# EAGLE schematic boardv2mcu (EAGLE 6.6.0)
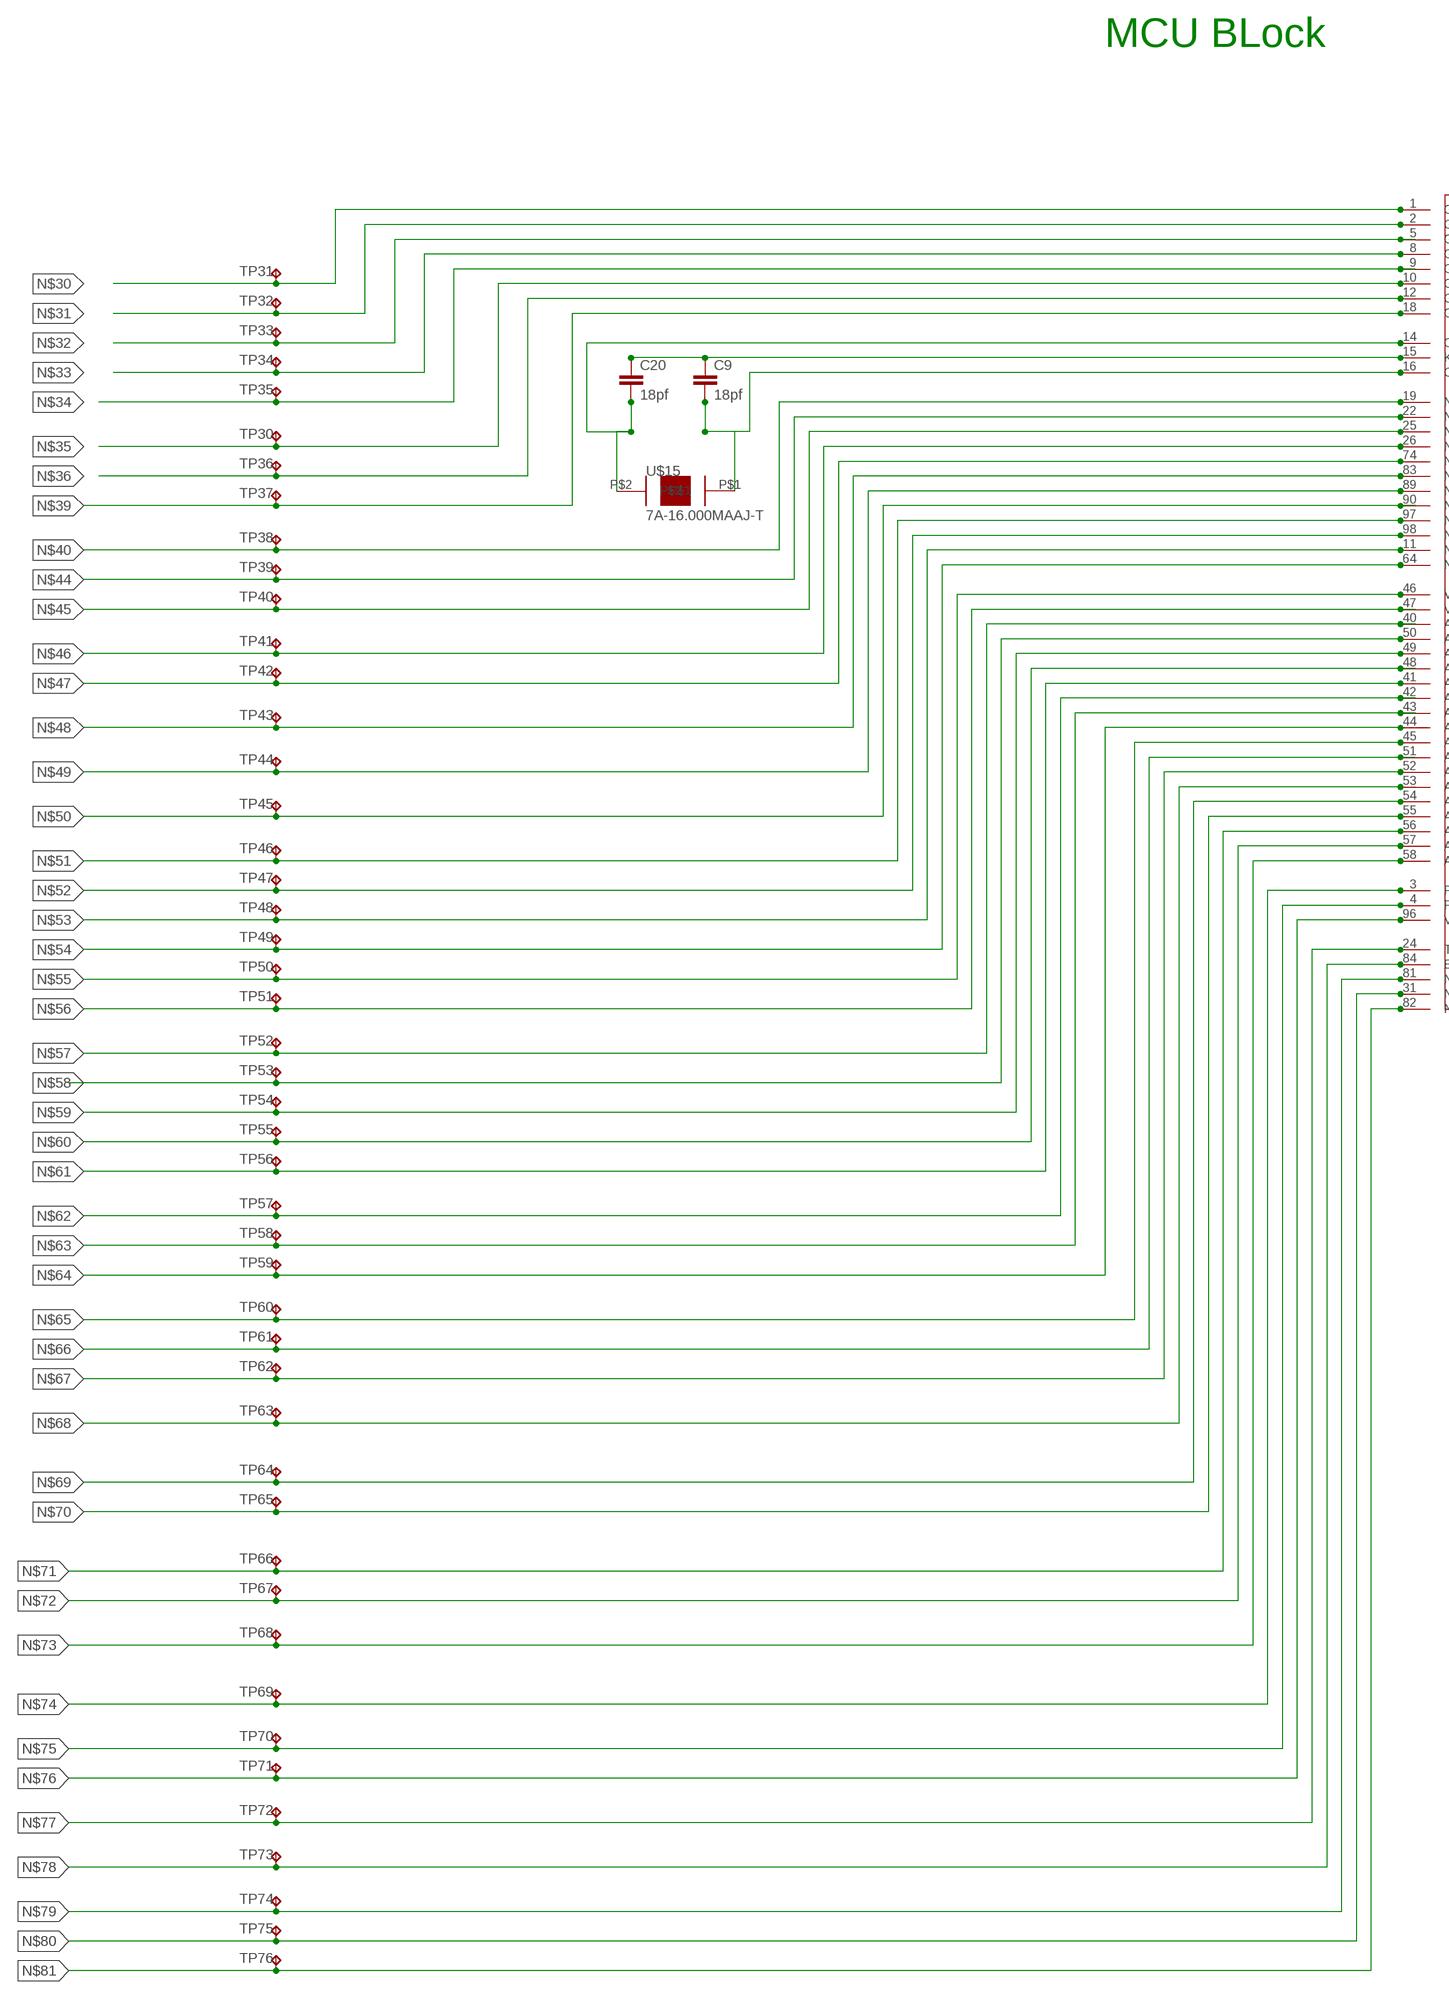
[diagram p0: schematic, sheet 1, part 1 of 2]
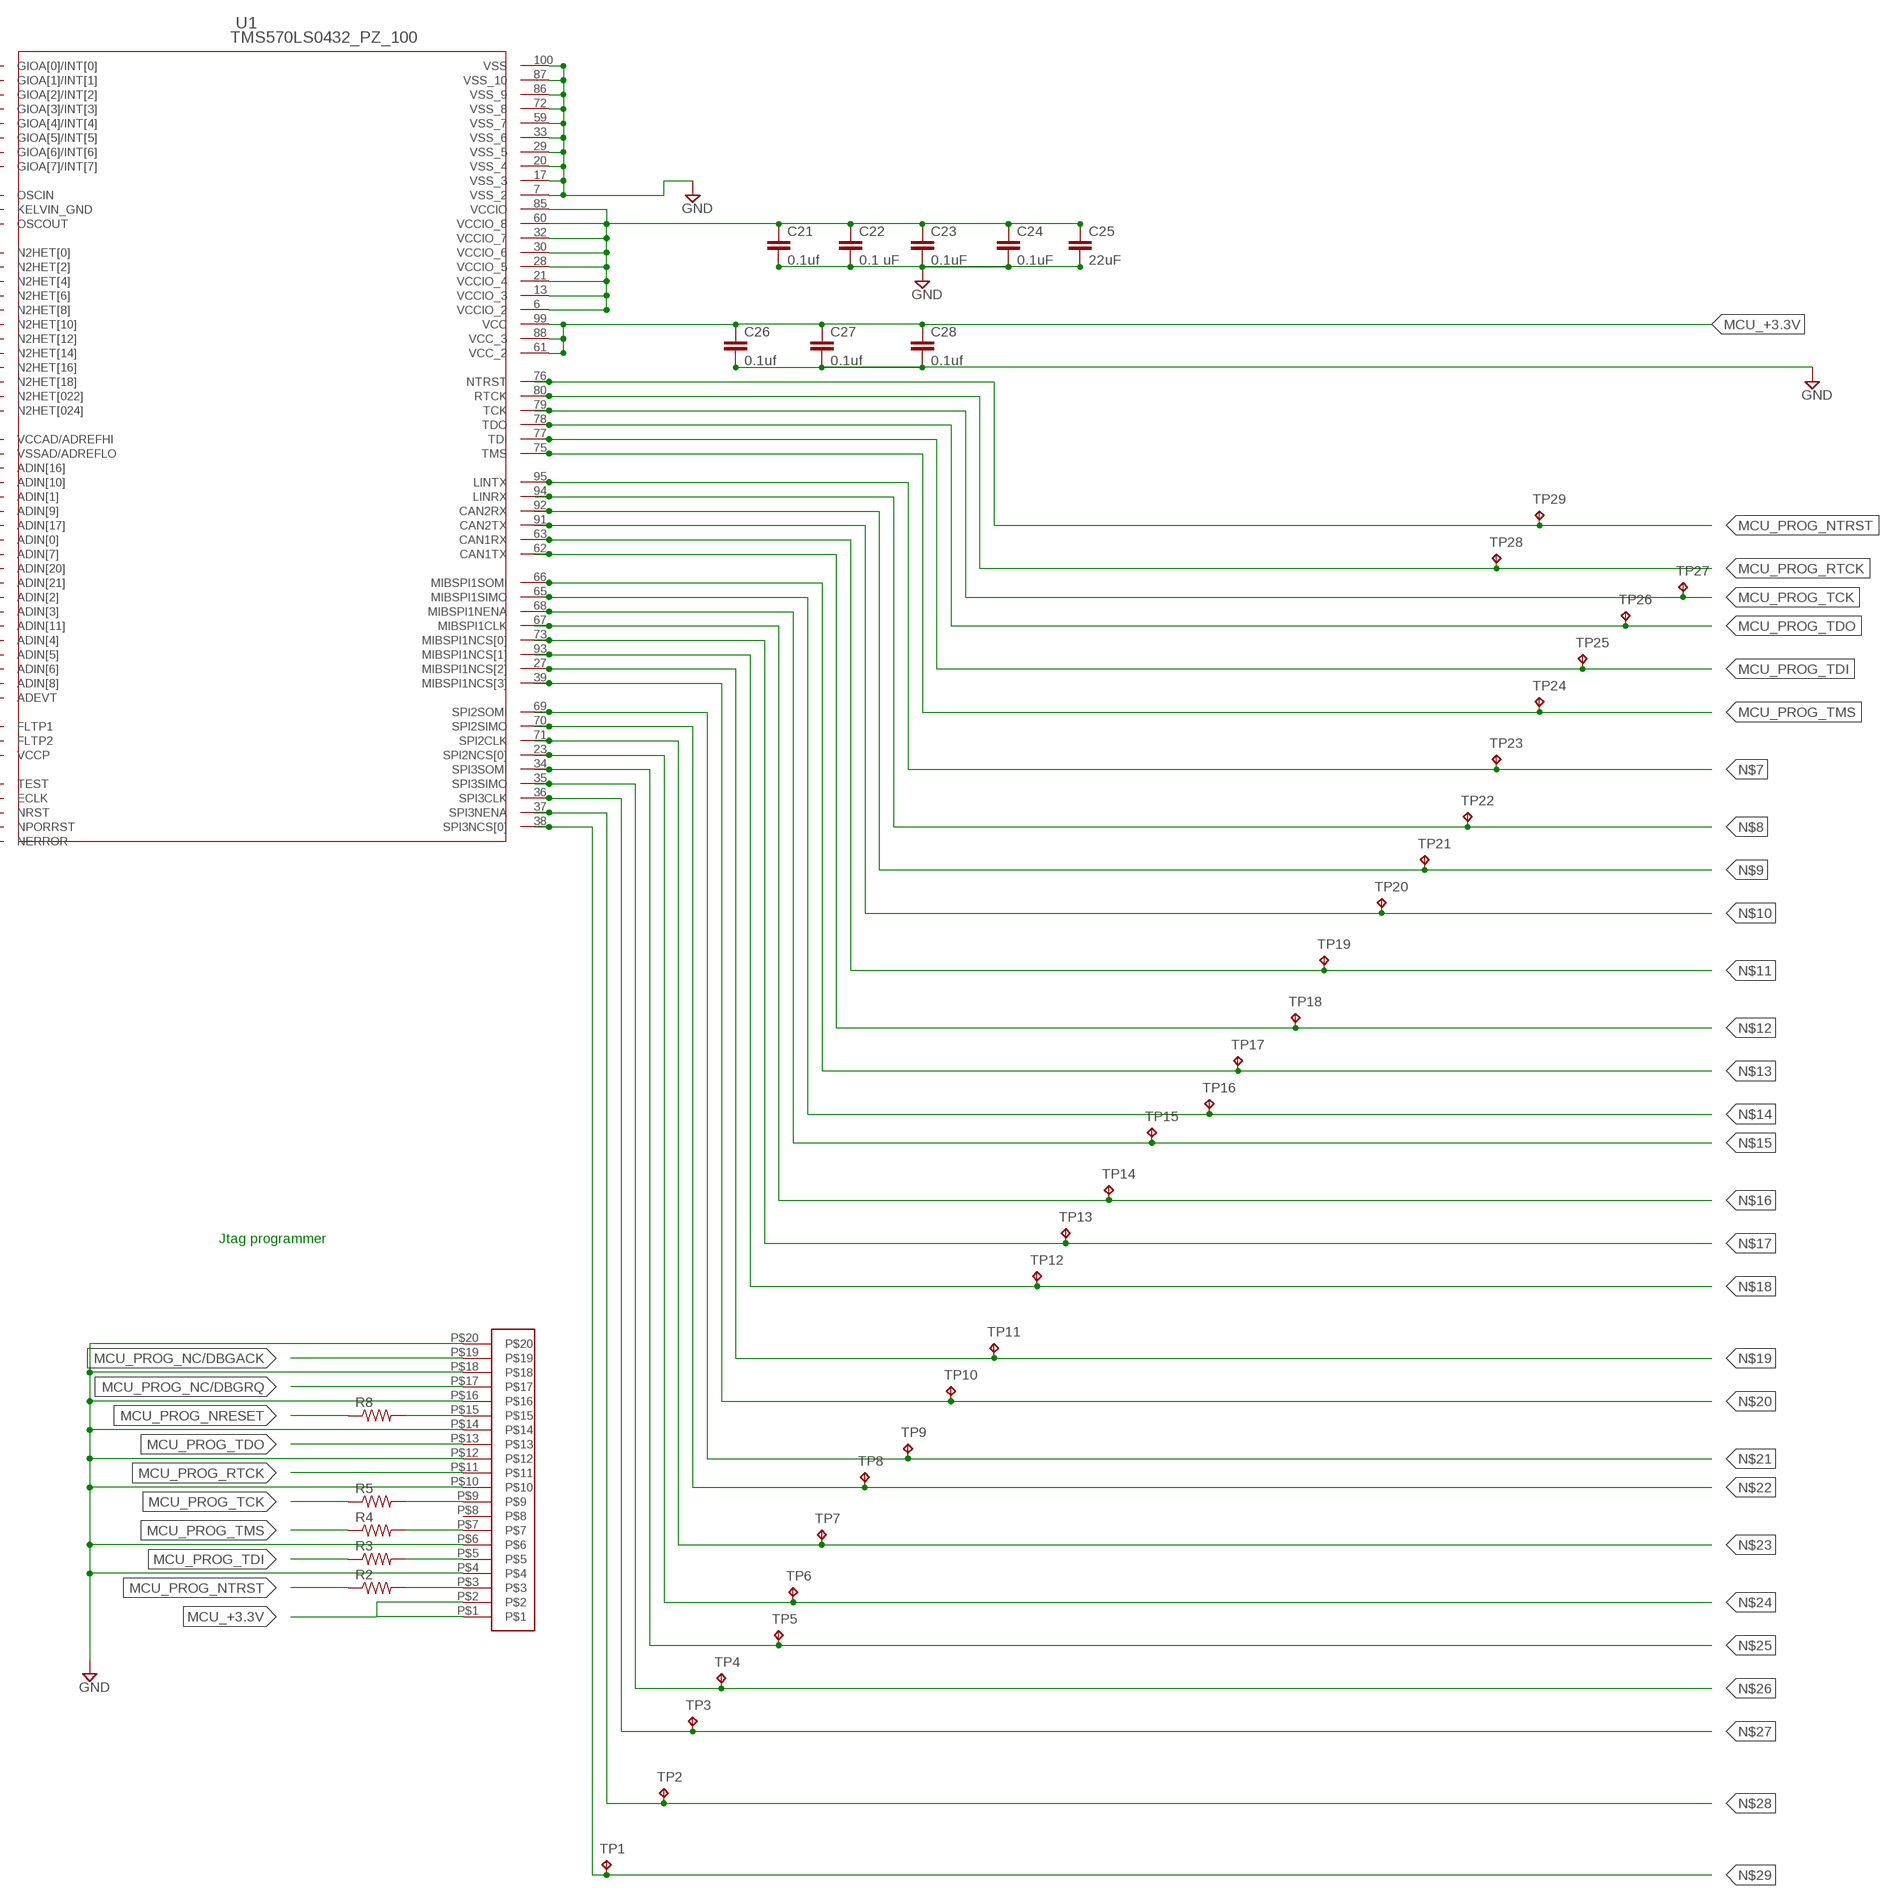
[diagram p1: schematic, sheet 1, part 2 of 2]

## Parts
C9  18pf  C-EUC0603  [C0603]
C20  18pf  C-EUC0603  [C0603]
C21  0.1uf  C-EUC0603  [C0603]
C22  0.1 uF  C-EUC0603  [C0603]
C23  0.1uF  C-EUC0603  [C0603]
C24  0.1uF  C-EUC0603  [C0603]
C25  22uF  C-EUC0603  [C0603]
C26  0.1uf  C-EUC0603  [C0603]
C27  0.1uf  C-EUC0603  [C0603]
C28  0.1uf  C-EUC0603  [C0603]
R2  RESISTOR0603-RES  [0603-RES]
R3  RESISTOR0603-RES  [0603-RES]
R4  RESISTOR0603-RES  [0603-RES]
R5  RESISTOR0603-RES  [0603-RES]
R8  RESISTOR0603-RES  [0603-RES]
TP1  TPB2,54  [B2,54]
TP2  TPB2,54  [B2,54]
TP3  TPB2,54  [B2,54]
TP4  TPB2,54  [B2,54]
TP5  TPB2,54  [B2,54]
TP6  TPB2,54  [B2,54]
TP7  TPB2,54  [B2,54]
TP8  TPB2,54  [B2,54]
TP9  TPB2,54  [B2,54]
TP10  TPB2,54  [B2,54]
TP11  TPB2,54  [B2,54]
TP12  TPB2,54  [B2,54]
TP13  TPB2,54  [B2,54]
TP14  TPB2,54  [B2,54]
TP15  TPB2,54  [B2,54]
TP16  TPB2,54  [B2,54]
TP17  TPB2,54  [B2,54]
TP18  TPB2,54  [B2,54]
TP19  TPB2,54  [B2,54]
TP20  TPB2,54  [B2,54]
TP21  TPB2,54  [B2,54]
TP22  TPB2,54  [B2,54]
TP23  TPB2,54  [B2,54]
TP24  TPB2,54  [B2,54]
TP25  TPB2,54  [B2,54]
TP26  TPB2,54  [B2,54]
TP27  TPB2,54  [B2,54]
TP28  TPB2,54  [B2,54]
TP29  TPB2,54  [B2,54]
TP30  TPB2,54  [B2,54]
TP31  TPB2,54  [B2,54]
TP32  TPB2,54  [B2,54]
TP33  TPB2,54  [B2,54]
TP34  TPB2,54  [B2,54]
TP35  TPB2,54  [B2,54]
TP36  TPB2,54  [B2,54]
TP37  TPB2,54  [B2,54]
TP38  TPB2,54  [B2,54]
TP39  TPB2,54  [B2,54]
TP40  TPB2,54  [B2,54]
TP41  TPB2,54  [B2,54]
TP42  TPB2,54  [B2,54]
TP43  TPB2,54  [B2,54]
TP44  TPB2,54  [B2,54]
TP45  TPB2,54  [B2,54]
TP46  TPB2,54  [B2,54]
TP47  TPB2,54  [B2,54]
TP48  TPB2,54  [B2,54]
TP49  TPB2,54  [B2,54]
TP50  TPB2,54  [B2,54]
TP51  TPB2,54  [B2,54]
TP52  TPB2,54  [B2,54]
TP53  TPB2,54  [B2,54]
TP54  TPB2,54  [B2,54]
TP55  TPB2,54  [B2,54]
TP56  TPB2,54  [B2,54]
TP57  TPB2,54  [B2,54]
TP58  TPB2,54  [B2,54]
TP59  TPB2,54  [B2,54]
TP60  TPB2,54  [B2,54]
TP61  TPB2,54  [B2,54]
TP62  TPB2,54  [B2,54]
TP63  TPB2,54  [B2,54]
TP64  TPB2,54  [B2,54]
TP65  TPB2,54  [B2,54]
TP66  TPB2,54  [B2,54]
TP67  TPB2,54  [B2,54]
TP68  TPB2,54  [B2,54]
TP69  TPB2,54  [B2,54]
TP70  TPB2,54  [B2,54]
TP71  TPB2,54  [B2,54]
TP72  TPB2,54  [B2,54]
TP73  TPB2,54  [B2,54]
TP74  TPB2,54  [B2,54]
TP75  TPB2,54  [B2,54]
TP76  TPB2,54  [B2,54]
U1  TMS570LS0432_PZ_100  [PZ100]
U$1  JTAG20PIN  [15-80-0201]
U$15  7A-16.000MAAJ-T  [2-SMD]

## Nets
GND: C21.2 C22.2 C23.2 C24.2 C25.2 C26.2 C27.2 C28.2 U1.7(VSS_2) U1.17(VSS_3) U1.20(VSS_4) U1.29(VSS_5) U1.33(VSS_6) U1.59(VSS_7) U1.72(VSS_8) U1.86(VSS_9) U1.87(VSS_10) U1.100(VSS) U$1.P$4 U$1.P$6 U$1.P$10 U$1.P$12 U$1.P$14 U$1.P$16 U$1.P$18 U$1.P$20
MCU_+3.3V: C26.1 C27.1 C28.1 U1.61(VCC_2) U1.88(VCC_3) U1.99(VCC) U$1.P$1 U$1.P$2
MCU_PROG_NC/DBGACK: U$1.P$19
MCU_PROG_NC/DBGRQ: U$1.P$17
MCU_PROG_NRESET: R8.1
MCU_PROG_NTRST: R2.2 TP29.TP U1.76(NTRST) U$1.P$3
MCU_PROG_RTCK: TP28.TP U1.80(RTCK) U$1.P$11
MCU_PROG_TCK: R5.2 TP27.TP U1.79(TCK) U$1.P$9
MCU_PROG_TDI: R3.2 TP25.TP U1.77(TDI) U$1.P$5
MCU_PROG_TDO: TP26.TP U1.78(TDO) U$1.P$13
MCU_PROG_TMS: R4.2 TP24.TP U1.75(TMS) U$1.P$7
N$7: TP23.TP U1.95(LINTX)
N$8: TP22.TP U1.94(LINRX)
N$9: TP21.TP U1.92(CAN2RX)
N$10: TP20.TP U1.91(CAN2TX)
N$11: TP19.TP U1.63(CAN1RX)
N$12: TP18.TP U1.62(CAN1TX)
N$13: TP17.TP U1.66(MIBSPI1SOMI)
N$14: TP16.TP U1.65(MIBSPI1SIMO)
N$15: TP15.TP U1.68(MIBSPI1NENA)
N$16: TP14.TP U1.67(MIBSPI1CLK)
N$17: TP13.TP U1.73(MIBSPI1NCS[0])
N$18: TP12.TP U1.93(MIBSPI1NCS[1])
N$19: TP11.TP U1.27(MIBSPI1NCS[2])
N$20: TP10.TP U1.39(MIBSPI1NCS[3])
N$21: TP9.TP U1.69(SPI2SOMI)
N$22: TP8.TP U1.70(SPI2SIMO)
N$23: TP7.TP U1.71(SPI2CLK)
N$24: TP6.TP U1.23(SPI2NCS[0])
N$25: TP5.TP U1.34(SPI3SOMI)
N$26: TP4.TP U1.35(SPI3SIMO)
N$27: TP3.TP U1.36(SPI3CLK)
N$28: TP2.TP U1.37(SPI3NENA)
N$29: TP1.TP U1.38(SPI3NCS[0])
N$30: TP31.TP U1.1(GIOA[0]/INT[0])
N$31: TP32.TP U1.2(GIOA[1]/INT[1])
N$32: TP33.TP U1.5(GIOA[2]/INT[2])
N$33: TP34.TP U1.8(GIOA[3]/INT[3])
N$34: TP35.TP U1.9(GIOA[4]/INT[4])
N$35: TP30.TP U1.10(GIOA[5]/INT[5])
N$36: TP36.TP U1.12(GIOA[6]/INT[6])
N$38: C21.1 C22.1 C23.1 C24.1 C25.1 U1.13(VCCIO_3) U1.21(VCCIO_4) U1.30(VCCIO_6) U1.85(VCCIO)
N$39: TP37.TP U1.18(GIOA[7]/INT[7])
N$40: TP38.TP U1.19(N2HET[0])
N$41: C9.1 C20.1 U1.15(KELVIN_GND)
N$42: C20.2 U1.14(OSCIN) U$15.P$2
N$43: C9.2 U1.16(OSCOUT) U$15.P$1
N$44: TP39.TP U1.22(N2HET[2])
N$45: TP40.TP U1.25(N2HET[4])
N$46: TP41.TP U1.26(N2HET[6])
N$47: TP42.TP U1.74(N2HET[8])
N$48: TP43.TP U1.83(N2HET[10])
N$49: TP44.TP U1.89(N2HET[12])
N$50: TP45.TP U1.90(N2HET[14])
N$51: TP46.TP U1.97(N2HET[16])
N$52: TP47.TP U1.98(N2HET[18])
N$53: TP48.TP U1.11(N2HET[022])
N$54: TP49.TP U1.64(N2HET[024])
N$55: TP50.TP U1.46(VCCAD/ADREFHI)
N$56: TP51.TP U1.47(VSSAD/ADREFLO)
N$57: TP52.TP U1.40(ADIN[16])
N$58: TP53.TP U1.50(ADIN[10])
N$59: TP54.TP U1.49(ADIN[1])
N$60: TP55.TP U1.48(ADIN[9])
N$61: TP56.TP U1.41(ADIN[17])
N$62: TP57.TP U1.42(ADIN[0])
N$63: TP58.TP U1.43(ADIN[7])
N$64: TP59.TP U1.44(ADIN[20])
N$65: TP60.TP U1.45(ADIN[21])
N$66: TP61.TP U1.51(ADIN[2])
N$67: TP62.TP U1.52(ADIN[3])
N$68: TP63.TP U1.53(ADIN[11])
N$69: TP64.TP U1.54(ADIN[4])
N$70: TP65.TP U1.55(ADIN[5])
N$71: TP66.TP U1.56(ADIN[6])
N$72: TP67.TP U1.57(ADIN[8])
N$73: TP68.TP U1.58(ADEVT)
N$74: TP69.TP U1.3(FLTP1)
N$75: TP70.TP U1.4(FLTP2)
N$76: TP71.TP U1.96(VCCP)
N$77: TP72.TP U1.24(TEST)
N$78: TP73.TP U1.84(ECLK)
N$79: TP74.TP U1.81(NRST)
N$80: TP75.TP U1.31(NPORRST)
N$81: TP76.TP U1.82(NERROR)
NRESET: R8.2 U$1.P$15
NTRST: R2.1
TCK: R5.1
TDI: R3.1
TMS: R4.1
Unconnected: U$1.P$8

## Notes on the sheet
- MCU BLock
- Jtag programmer

## Power pins joined to a net without a drawn wire
VCCIO_2: U1.6(VCCIO_2)
VCCIO_5: U1.28(VCCIO_5)
VCCIO_7: U1.32(VCCIO_7)
VCCIO_8: U1.60(VCCIO_8)

## Library data of the parts
C9 C20-C28 = rcl:C-EU: CAPACITOR, European symbol
R2-R5 R8 = SparkFun-Passives:RESISTOR: Resistor Basic schematic elements and footprints for 0603, 1206, and PTH resistors.
TP1-TP76 = testpad:TP: Test pad
U1 = version2:TMS570LS0432_PZ_100; MANUFACTURER_PART_NUMBER: tms570ls0432_pz_100; VENDOR: TEXAS INSTRUMENTS
U$1 = connectors:JTAG20PIN
U$15 = version2:7A-16.000MAAJ-T

## Net classes
0 default: width 0.203 mm, drill 0.406 mm, clearance 0.102 mm
1 power: width 0.203 mm, drill 0.406 mm, clearance 0.203 mm
2 gnd: width 0.203 mm, drill 0.406 mm, clearance 0.203 mm
3 power usb: width 0.508 mm, drill 0.406 mm, clearance 0.203 mm